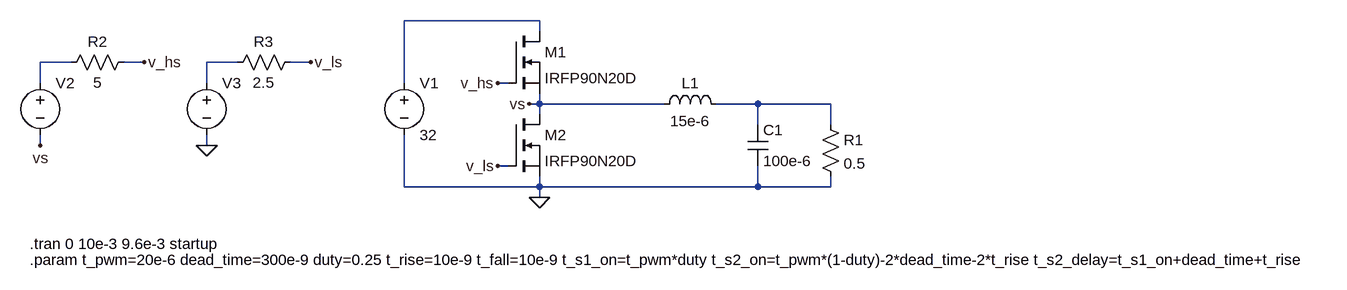
[diagram p0: schematic buck.asc]
buck.asc, the LTspice schematic file:
Version 4
SHEET 1 1628 680
WIRE 160 64 -48 64
WIRE 160 80 160 64
WIRE -560 128 -608 128
WIRE -448 128 -480 128
WIRE -304 128 -352 128
WIRE -192 128 -224 128
WIRE -608 160 -608 128
WIRE -352 160 -352 128
WIRE -48 160 -48 64
WIRE 112 160 96 160
WIRE 160 192 160 176
WIRE 160 192 144 192
WIRE 352 192 160 192
WIRE 496 192 432 192
WIRE 608 192 496 192
WIRE 160 208 160 192
WIRE 496 224 496 192
WIRE 608 224 608 192
WIRE -608 256 -608 240
WIRE -352 256 -352 240
WIRE 112 288 96 288
WIRE -48 320 -48 240
WIRE 160 320 160 304
WIRE 160 320 -48 320
WIRE 496 320 496 288
WIRE 496 320 160 320
WIRE 608 320 608 304
WIRE 608 320 496 320
WIRE 160 336 160 320
FLAG 144 192 vs
FLAG -448 128 v_hs
FLAG -608 256 vs
FLAG 96 160 v_hs
FLAG 160 336 0
FLAG -352 256 0
FLAG -192 128 v_ls
FLAG 96 288 v_ls
SYMBOL ind 336 208 R270
WINDOW 0 32 56 VTop 2
WINDOW 3 5 56 VBottom 2
SYMATTR InstName L1
SYMATTR Value 15e-6
SYMATTR SpiceLine Rser=15e-3
SYMBOL cap 480 224 R0
SYMATTR InstName C1
SYMATTR Value 100e-6
SYMATTR SpiceLine Rser=20e-3
SYMBOL res 592 208 R0
SYMATTR InstName R1
SYMATTR Value 0.5
SYMBOL voltage -48 144 R0
WINDOW 123 0 0 Left 0
WINDOW 39 0 0 Left 0
SYMATTR InstName V1
SYMATTR Value 32
SYMBOL res -464 112 R90
WINDOW 0 0 56 VBottom 2
WINDOW 3 32 56 VTop 2
SYMATTR InstName R2
SYMATTR Value 5
SYMBOL res -208 112 R90
WINDOW 0 0 56 VBottom 2
WINDOW 3 32 56 VTop 2
SYMATTR InstName R3
SYMATTR Value 2.5
SYMBOL nmos 112 208 R0
SYMATTR InstName M2
SYMATTR Value IRFP90N20D
SYMBOL nmos 112 80 R0
SYMATTR InstName M1
SYMATTR Value IRFP90N20D
SYMBOL voltage -608 144 R0
WINDOW 3 24 96 Invisible 2
WINDOW 123 0 0 Left 0
WINDOW 39 0 0 Left 0
SYMATTR Value PULSE(0 13 0 {t_rise} {t_fall} {t_s1_on} {t_pwm})
SYMATTR InstName V2
SYMBOL voltage -352 144 R0
WINDOW 3 24 96 Invisible 2
WINDOW 123 0 0 Left 0
WINDOW 39 0 0 Left 0
SYMATTR Value PULSE(0 13 {t_s2_delay} {t_rise} {t_fall} {t_s2_on} {t_pwm})
SYMATTR InstName V3
TEXT -624 408 Left 2 !.tran 0 10e-3 9.6e-3 startup
TEXT -624 432 Left 2 !.param t_pwm=20e-6 dead_time=300e-9 duty=0.25 t_rise=10e-9 t_fall=10e-9 t_s1_on=t_pwm*duty t_s2_on=t_pwm*(1-duty)-2*dead_time-2*t_rise t_s2_delay=t_s1_on+dead_time+t_rise

The netlist it stands for:
* buck.asc
L1 vs N004 15e-6 Rser=15e-3
C1 N004 0 100e-6 Rser=20e-3
R1 N004 0 0.5
V1 N001 0 32
R2 v_hs N002 5
R3 v_ls N003 2.5
M2 vs v_ls 0 0 IRFP90N20D
M1 N001 v_hs vs vs IRFP90N20D
V2 N002 vs PULSE(0 13 0 {t_rise} {t_fall} {t_s1_on} {t_pwm})
V3 N003 0 PULSE(0 13 {t_s2_delay} {t_rise} {t_fall} {t_s2_on} {t_pwm})
.model NMOS NMOS
.model PMOS PMOS
.lib standard.mos
.tran 0 10e-3 9.6e-3 startup
.param t_pwm=20e-6 dead_time=300e-9 duty=0.25 t_rise=10e-9 t_fall=10e-9 t_s1_on=t_pwm*duty t_s2_on=t_pwm*(1-duty)-2*dead_time-2*t_rise t_s2_delay=t_s1_on+dead_time+t_rise
.backanno
.end